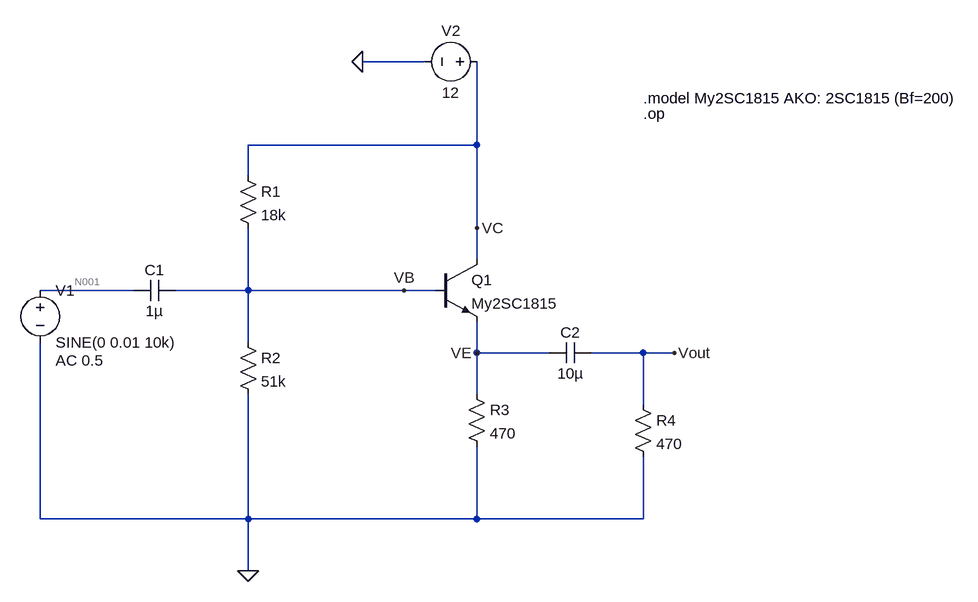
[diagram p0: schematic Draft6.asc]
Draft6.asc, the LTspice schematic file:
Version 4.1
SHEET 1 1332 680
WIRE 480 -224 384 -224
WIRE 560 -96 560 -224
WIRE 560 -96 208 -96
WIRE 208 -48 208 -96
WIRE 560 32 560 -96
WIRE 560 80 560 32
WIRE 32 128 -112 128
WIRE 208 128 208 32
WIRE 208 128 96 128
WIRE 448 128 208 128
WIRE 496 128 448 128
WIRE 208 208 208 128
WIRE 560 224 560 176
WIRE 672 224 560 224
WIRE 816 224 736 224
WIRE 864 224 816 224
WIRE 560 288 560 224
WIRE 816 304 816 224
WIRE -112 480 -112 208
WIRE 208 480 208 288
WIRE 208 480 -112 480
WIRE 560 480 560 368
WIRE 560 480 208 480
WIRE 816 480 816 384
WIRE 816 480 560 480
WIRE 208 560 208 480
FLAG 384 -224 0
FLAG 208 560 0
FLAG 864 224 Vout
FLAG 448 128 VB
FLAG 560 32 VC
FLAG 560 224 VE
SYMBOL cap 96 112 R90
WINDOW 0 0 32 VBottom 2
WINDOW 3 32 32 VTop 2
SYMATTR InstName C1
SYMATTR Value 1µ
SYMBOL cap 736 208 R90
WINDOW 0 0 32 VBottom 2
WINDOW 3 32 32 VTop 2
SYMATTR InstName C2
SYMATTR Value 10µ
SYMBOL res 192 -64 R0
SYMATTR InstName R1
SYMATTR Value 18k
SYMBOL res 192 192 R0
SYMATTR InstName R2
SYMATTR Value 51k
SYMBOL res 544 272 R0
SYMATTR InstName R3
SYMATTR Value 470
SYMBOL res 800 288 R0
SYMATTR InstName R4
SYMATTR Value 470
SYMBOL npn 496 80 R0
SYMATTR InstName Q1
SYMATTR Value My2SC1815
SYMBOL voltage -112 112 R0
WINDOW 123 24 124 Left 2
WINDOW 39 0 0 Left 0
SYMATTR InstName V1
SYMATTR Value SINE(0 0.01 10k)
SYMATTR Value2 AC 0.5
SYMBOL voltage 576 -224 R90
WINDOW 0 -32 56 VBottom 2
WINDOW 3 32 56 VTop 2
SYMATTR InstName V2
SYMATTR Value 12
TEXT 816 -168 Left 2 !.model My2SC1815 AKO: 2SC1815 (Bf=200)
TEXT 816 -144 Left 2 !.op

The netlist it stands for:
* Draft6.asc
C1 VB N001 1µ
C2 Vout VE 10µ
R1 VC VB 18k
R2 VB 0 51k
R3 VE 0 470
R4 Vout 0 470
Q1 VC VB VE 0 My2SC1815
V1 N001 0 SINE(0 0.01 10k) AC 0.5
V2 VC 0 12
.model NPN NPN
.model PNP PNP
.lib standard.bjt
.model My2SC1815 AKO: 2SC1815 (Bf=200)
.op
.backanno
.end

* Results of the author's LTspice run, read from the files saved beside the schematic
* Operating Point:
*   V(n001) = 0 V
*   V(ve) = 7.217 V
*   V(vc) = 12 V
*   V(vb) = 7.98 V
*   V(vout) = 33.92 fV
*   I(R3) = 15.35 mA
*   I(R4) = 0 A
*   I(V1) = 0 A
*   I(C1) = 0 A
*   I(R1) = 223.3 µA
*   I(R2) = 156.5 µA
*   Ic(Q1) = 15.29 mA
*   Ib(Q1) = 66.86 µA
*   Ie(Q1) = -15.35 mA
*   Is(Q1) = 0 A
*   I(C2) = 0 A
*   I(V2) = -15.51 mA